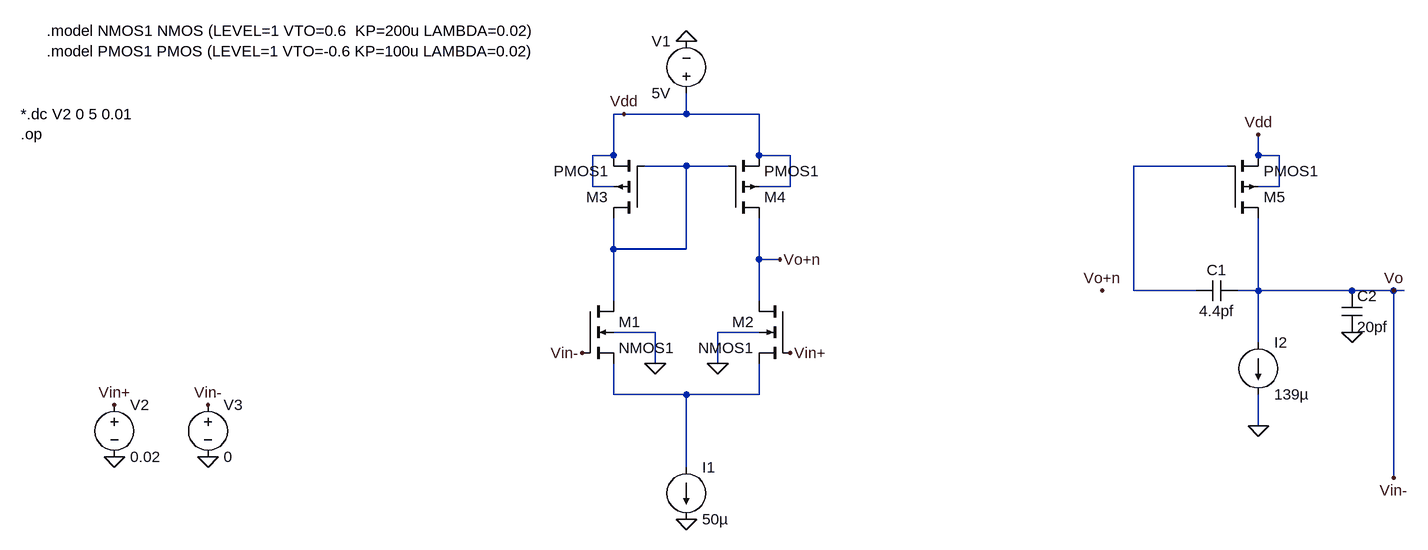
[diagram p0: schematic NMOS_diff_pair.asc]
NMOS_diff_pair.asc, the LTspice schematic file:
Version 4.1
SHEET 1 1168 680
WIRE -48 0 -64 0
WIRE 48 0 48 -32
WIRE 48 0 -48 0
WIRE 160 0 48 0
WIRE -64 64 -64 0
WIRE -64 64 -96 64
WIRE 160 64 160 0
WIRE 208 64 160 64
WIRE 928 64 928 32
WIRE 960 64 928 64
WIRE 48 80 -16 80
WIRE 112 80 48 80
WIRE 880 80 736 80
WIRE -96 112 -96 64
WIRE -64 112 -96 112
WIRE 208 112 208 64
WIRE 208 112 160 112
WIRE 960 112 960 64
WIRE 960 112 928 112
WIRE -64 208 -64 160
WIRE 48 208 48 80
WIRE 48 208 -64 208
WIRE 160 224 160 160
WIRE 192 224 160 224
WIRE 736 272 736 80
WIRE 832 272 736 272
WIRE 928 272 928 160
WIRE 928 272 896 272
WIRE 1072 272 928 272
WIRE 1136 272 1072 272
WIRE 1152 272 1136 272
WIRE -64 288 -64 208
WIRE 160 288 160 224
WIRE 0 336 -64 336
WIRE 160 336 96 336
WIRE 928 352 928 272
WIRE 0 384 0 336
WIRE 96 384 96 336
WIRE -64 432 -64 384
WIRE 48 432 -64 432
WIRE 160 432 160 384
WIRE 160 432 48 432
WIRE 928 480 928 432
WIRE 48 544 48 432
WIRE 1136 560 1136 272
FLAG 48 -112 0
FLAG 0 384 0
FLAG 96 384 0
FLAG -48 0 Vdd
FLAG 208 368 Vin+
FLAG -112 368 Vin-
FLAG 48 624 0
FLAG 192 224 Vo+n
FLAG 928 32 Vdd
FLAG 1136 272 Vo
FLAG 1072 336 0
FLAG 688 272 Vo+n
FLAG 928 480 0
FLAG 1136 560 Vin-
FLAG -832 528 0
FLAG -832 448 Vin+
FLAG -688 528 0
FLAG -688 448 Vin-
DATAFLAG 0 432 ""
DATAFLAG 160 208 ""
DATAFLAG -64 208 ""
DATAFLAG 128 0 ""
SYMBOL nmos4 -112 288 R0
SYMATTR InstName M1
SYMATTR Value NMOS1
SYMATTR Value2 l=300n w=300n
SYMBOL nmos4 208 288 M0
SYMATTR InstName M2
SYMATTR Value NMOS1
SYMATTR Value2 l=300n w=300n
SYMBOL voltage 48 -16 R180
WINDOW 0 24 96 Left 2
WINDOW 3 24 16 Left 2
WINDOW 123 0 0 Left 0
WINDOW 39 0 0 Left 0
SYMATTR InstName V1
SYMATTR Value 5V
SYMBOL pmos4 -16 160 R180
SYMATTR InstName M3
SYMATTR Value PMOS1
SYMATTR Value2 l=300n w=600n
SYMBOL pmos4 112 160 M180
SYMATTR InstName M4
SYMATTR Value PMOS1
SYMATTR Value2 l=300n w=600n
SYMBOL current 48 544 R0
WINDOW 123 0 0 Left 0
WINDOW 39 0 0 Left 0
SYMATTR InstName I1
SYMATTR Value 50µ
SYMBOL cap 896 256 R90
WINDOW 0 0 32 VBottom 2
WINDOW 3 32 32 VTop 2
SYMATTR InstName C1
SYMATTR Value 4.4pf
SYMBOL pmos4 880 160 M180
SYMATTR InstName M5
SYMATTR Value PMOS1
SYMATTR Value2 l=300n w=3300n
SYMBOL cap 1056 272 R0
SYMATTR InstName C2
SYMATTR Value 20pf
SYMBOL current 928 352 R0
WINDOW 123 0 0 Left 0
WINDOW 39 0 0 Left 0
SYMATTR InstName I2
SYMATTR Value 139µ
SYMBOL voltage -832 432 R0
WINDOW 123 0 0 Left 0
WINDOW 39 0 0 Left 0
SYMATTR InstName V2
SYMATTR Value 0.02
SYMBOL voltage -688 432 R0
WINDOW 123 0 0 Left 0
WINDOW 39 0 0 Left 0
SYMATTR InstName V3
SYMATTR Value 0
TEXT -976 0 Left 2 !*.dc V2 0 5 0.01\n.op
TEXT -936 -128 Left 2 !.model NMOS1 NMOS (LEVEL=1 VTO=0.6  KP=200u LAMBDA=0.02)\n.model PMOS1 PMOS (LEVEL=1 VTO=-0.6 KP=100u LAMBDA=0.02)

The netlist it stands for:
* NMOS_diff_pair.asc
M1 N001 Vo N003 0 NMOS1 l=300n w=300n
M2 Vo+n Vin+ N003 0 NMOS1 l=300n w=300n
V1 Vdd 0 5V
M3 N001 N001 Vdd Vdd PMOS1 l=300n w=600n
M4 Vo+n N001 Vdd Vdd PMOS1 l=300n w=600n
I1 N003 0 50µ
C1 Vo N002 4.4pf
M5 Vo N002 Vdd Vdd PMOS1 l=300n w=3300n
C2 Vo 0 20pf
I2 Vo 0 139µ
V2 Vin+ 0 0.02
V3 Vo 0 0
.model NMOS NMOS
.model PMOS PMOS
.lib standard.mos
*.dc V2 0 5 0.01
.op
.model NMOS1 NMOS (LEVEL=1 VTO=0.6  KP=200u LAMBDA=0.02)
.model PMOS1 PMOS (LEVEL=1 VTO=-0.6 KP=100u LAMBDA=0.02)
.backanno
.end